# Altium schematic sheet dAir-type-C_0.0.0.4_07052022.SchDoc
size A3
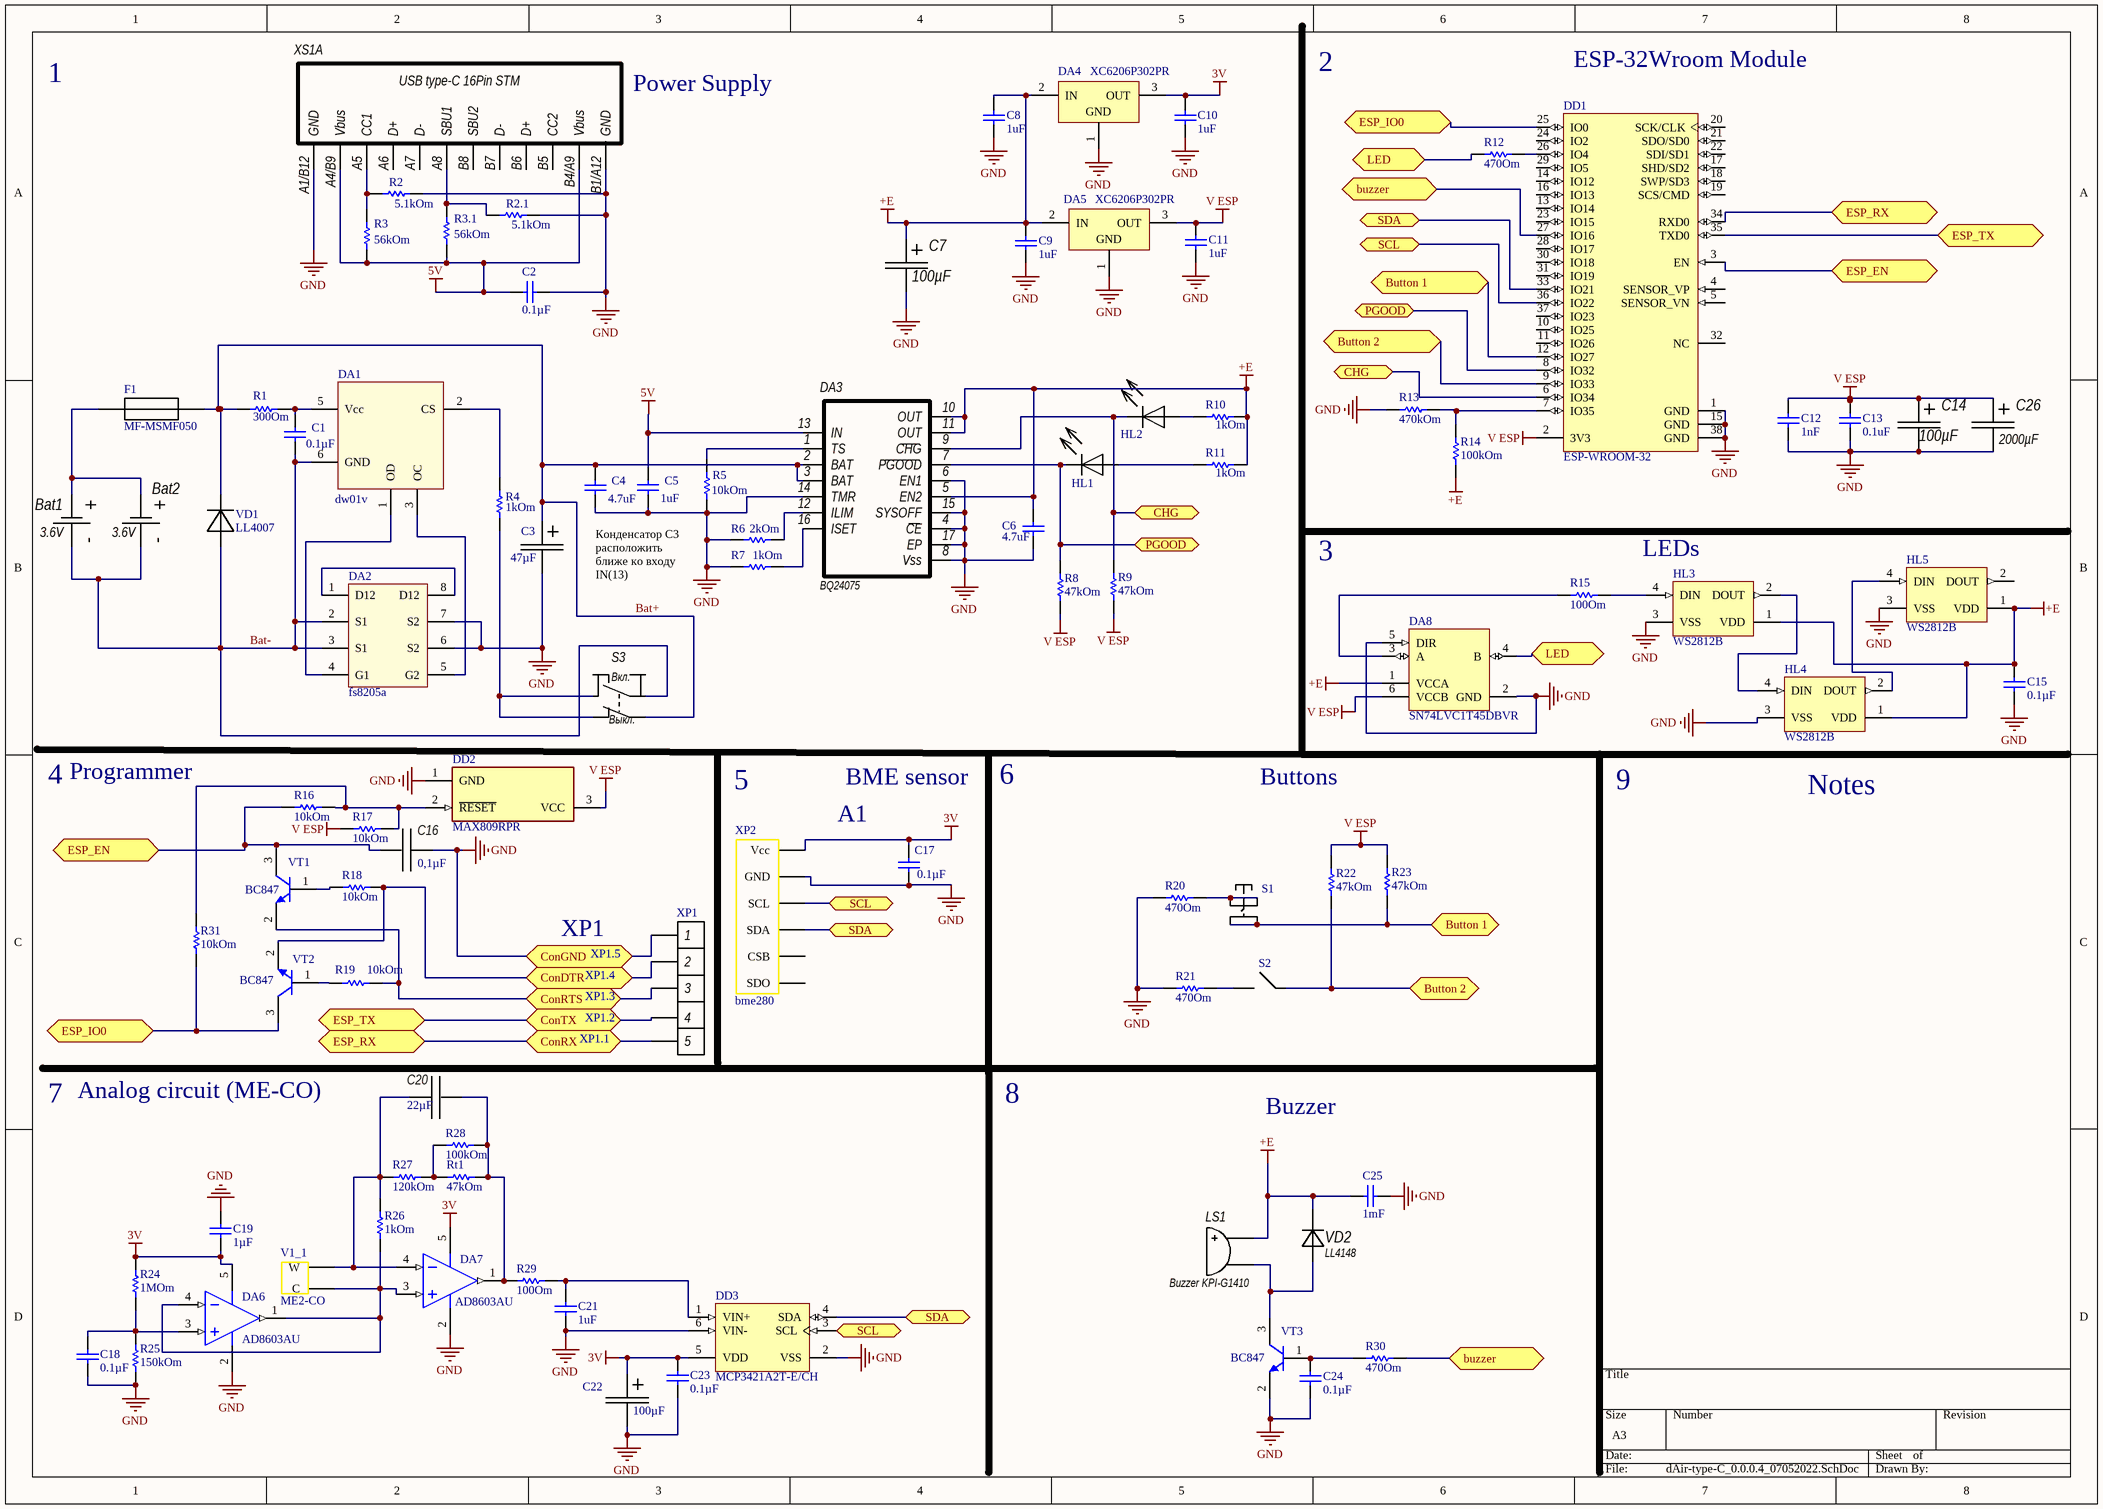
[diagram p0: dAir-type-C_0.0.0.4_07052022.SchDoc]

## Parts
Bat1  3.6V  [Bat_18650_KEYS54]
Bat2  3.6V  [Bat_18650_KEYS54]
C1  0.1µF  [CAPC0805(2012)155_L]
C2  0.1µF  [CAPC0805(2012)155_L]
C3  47µF  [Tantal_type_A_and_B]
C4  4.7uF  [CAPC0805(2012)155_L]
C5  1uF  [CAPC0805(2012)155_L]
C6  4.7uF  [CAPC0805(2012)155_L]
C7  100µF  [Tantal_type_A_and_B]
C8  1uF  [CAPC0805(2012)155_L]
C9  1uF  [CAPC0805(2012)155_L]
C10  1uF  [CAPC0805(2012)155_L]
C11  1uF  [CAPC0805(2012)155_L]
C12  1nF  [CAPC0805(2012)155_L]
C13  0.1uF  [CAPC0805(2012)155_L]
C14  100µF  [Tantal_type_A_and_B]
C15  0.1µF  [CAPC0805(2012)155_L]
C16  0,1µF  [Cap 0805]
C17  0.1µF  [CAPC0805(2012)155_L]
C18  0.1µF  [CAPC0805(2012)155_L]
C19  1µF  [CAPC0805(2012)155_L]
C20  22µF  [Cap 0805]
C21  1uF  [CAPC0805(2012)155_L]
C22  100µF  [Tantal_type_A_and_B]
C23  0.1µF  [CAPC0805(2012)155_L]
C24  0.1µF  [CAPC0805(2012)155_L]
C25  1mF  [CAPC0805(2012)155_L]
C26  2000µF  [Capacitor_radial_13x21_5mm_angel]
DA1  dw01v  [dw01v_SOT-23-6]
DA2  fs8205a  [FS8205_TSSOP-8]
DA3  BQ24075  [VQFN_16]
DA4  XC6206P302PR  [SOT89_N]
DA5  XC6206P302PR  [SOT89_N]
DA6  AD8603AU  [ADI-UJ-5_M]
DA7  AD8603AU  [ADI-UJ-5_M]
DA8  SN74LVC1T45DBVR  [DBV0006A_L]
DD1  ESP-WROOM-32  [OLMX-ESP-WROOM-32]
DD2  MAX809RPR  [FP-318-08-MFG]
DD3  MCP3421A2T-E/CH  [SOT-23-CH6_L]
F1  MF-MSMF050  [FUSE_MF-MSMF050]
HL1  GNL-1206SRC  [LED_SMT-3.2x1.6x1.1]  (value not drawn)
HL2  GNL-1206SRC  [LED_SMT-3.2x1.6x1.1]  (value not drawn)
HL3  WS2812B  [ADAI-WS2812B_V]
HL4  WS2812B  [ADAI-WS2812B_V]
HL5  WS2812B  [ADAI-WS2812B_V]
LS1  Buzzer KPI-G1410  [KPI-G1410]
R1  300Om  [RESC0805(2012)_M]
R2  5.1kOm  [RESC0805(2012)_M]
R2.1  5.1kOm  [RESC0805(2012)_M]
R3  56kOm  [RESC0805(2012)_M]
R3.1  56kOm  [RESC0805(2012)_M]
R4  1kOm  [RESC0805(2012)_M]
R5  10kOm  [RESC0805(2012)_M]
R6  2kOm  [RESC0805(2012)_M]
R7  1kOm  [RESC0805(2012)_M]
R8  47kOm  [RESC0805(2012)_M]
R9  47kOm  [RESC0805(2012)_M]
R10  1kOm  [RESC0805(2012)_M]
R11  1kOm  [RESC0805(2012)_M]
R12  470Om  [RESC0805(2012)_M]
R13  470kOm  [RESC0805(2012)_M]
R14  100kOm  [RESC0805(2012)_M]
R15  100Om  [RESC0805(2012)_M]
R16  10kOm  [RESC0805(2012)_M]
R17  10kOm  [RESC0805(2012)_M]
R18  10kOm  [RESC0805(2012)_M]
R19  10kOm  [RESC0805(2012)_M]
R20  470Om  [RESC0805(2012)_M]
R21  470Om  [RESC0805(2012)_M]
R22  47kOm  [RESC0805(2012)_M]
R23  47kOm  [RESC0805(2012)_M]
R24  1MOm  [RESC0805(2012)_M]
R25  150kOm  [RESC0805(2012)_M]
R26  1kOm  [RESC0805(2012)_M]
R27  120kOm  [RESC0805(2012)_M]
R28  100kOm  [RESC0805(2012)_M]
R29  100Om  [RESC0805(2012)_M]
R30  470Om  [RESC0805(2012)_M]
R31  10kOm  [RESC0805(2012)_M]
Rt1  47kOm  [RESC0805(2012)_M]
S1  KLS7-TS6604-7.0 or IT1102WB  [Кнопка тактовая прямая SMT 7mm]  (value not drawn)
S2  KLS7-TS6606-8.0 or TS-A3PV  [Кнопка тактовая 8,0мм]  (value not drawn)
S3  Кнопка переключающая типа DPDT  [Кнопка типа DPDT 5.8x5.8x10.1 угловая]  (value not drawn)
V1_1  ME2-CO  [ME2_CO]
VD1  LL4007  [MELF/DO-213AB]
VD2  LL4148  [Zener diod (sod80c)]
VT1  BC847  [ONSC-SOT-23-3-318-08_V]
VT2  BC847  [ONSC-SOT-23-3-318-08_V]
VT3  BC847  [ONSC-SOT-23-3-318-08_V]
XP1  XP1  [Pin 5x2.54]  (value not drawn)
XP2  bme280  [BME680 вертикальная утсановка]
XS1A  CON USB_TypeC-16Pin  [USB_type_c_16P_SMT]  (value not drawn)

## Ports
Button 1 (bidir), Button 2 (bidir), buzzer (bidir), CHG (bidir), ConDTR (bidir), ConGND (bidir), ConRTS (bidir), ConRX (bidir), ConTX (bidir), ESP_EN (bidir), ESP_IO0 (bidir), ESP_RX (bidir), ESP_TX (bidir), LED (bidir), PGOOD (bidir), SCL (bidir), SDA (bidir)

## Nets
3V: C10.2 C17.2 C19.1 C22.1(+) C23.2 DA4.3(OUT) DA6.5(+V) DA7.5(+V) DD3.5(VDD) R24.2 XP2.1(Vcc)
5V: C2.1 C5.1 DA3.13(IN) R3.2 R3.1.2 XS1A.A4/B9(Vbus) XS1A.B4/A9(Vbus)
+E: C6.1 C7.1(+) C8.2 C9.2 C15.2 C25.1 DA3.5(EN2) DA3.10(OUT) DA3.11(OUT) DA4.2(IN) DA5.2(IN) DA8.1(VCCA) HL3.1(VDD) HL4.1(VDD) HL5.1(VDD) LS1.1 R10.1 R11.1 R14.2 VD2.1
GND: C2.2 C3.2(-) C4.2 C5.2 C6.2 C7.2(-) C8.1 C9.1 C10.1 C11.1 C12.1 C13.1 C14.2(-) C15.1 C16.2 C17.1 C18.1 C19.2 C21.2 C22.2(-) C23.1 C24.2 C25.2 C26.2(-) DA2.6(S2) DA2.7(S2) DA3.4(CE) DA3.6(EN1) DA3.8(Vss) DA3.14(TMR) DA3.15(SYSOFF) DA3.17(EP) DA4.1(GND) DA5.1(GND) DA6.2(-V) DA7.2(-V) DA8.2(GND) DA8.5(DIR) DD1.1(GND) DD1.15(GND) DD1.38(GND) DD2.1(GND) DD3.2(VSS) DD3.6(VIN-) HL3.3(VSS) HL4.3(VSS) HL5.3(VSS) R2.1 R2.1.1 R5.2 R6.2 R7.2 R13.1 R20.1 R21.1 R25.1 VT3.2(E) XP1.1 XP2.2(GND) XS1A.A1/B12(GND) XS1A.B1/A12(GND) ; port ConGND
V ESP: C11.2 C12.2 C13.2 C14.1(+) C26.1(+) DA5.3(OUT) DA8.6(VCCB) DD1.2(3V3) DD2.3(VCC) R8.1 R9.1 R17.2 R22.2 R23.2
Bat+: C3.1(+) C4.1 DA3.2(BAT) DA3.3(BAT) F1.2 R1.1 S3.3 VD1.1
Bat-: Bat1.2(Bat-) Bat2.2(Bat-) C1.2 DA1.6(GND) DA2.2(S1) DA2.3(S1) S3.4 VD1.2
Button 1: DD1.12(IO27) R23.1 S1.3 S1.4 ; port Button 1
Button 2: DD1.9(IO33) R22.1 S2.2 ; port Button 2
buzzer: DD1.27(IO16) R30.2 ; port buzzer
CHG: DA3.9(CHG) DD1.6(IO34) HL2.1 R9.2 ; port CHG
ConDTR: R18.2 VT2.2(E) XP1.2 ; port ConDTR
ConRTS: R19.2 VT1.2(E) XP1.3 ; port ConRTS
ConRX: DD1.34(RXD0) XP1.5 ; port ConRX, port ESP_RX
ConTX: DD1.35(TXD0) XP1.4 ; port ConTX, port ESP_TX
ESP_EN: C16.1 DD1.3(EN) R16.2 VT1.3(C) ; port ESP_EN
ESP_IO0: DD1.25(IO0) R31.1 VT2.3(C) ; port ESP_IO0
LED: DA8.4(B) R12.1 ; port LED
PGOOD: DA3.7(PGOOD) DD1.8(IO32) HL1.1 R8.2 ; port PGOOD
SCL: DD1.36(IO22) DD3.3(SCL) XP2.3(SCL) ; port SCL
SDA: DD1.33(IO21) DD3.4(SDA) XP2.4(SDA) ; port SDA
NetBat1_1: Bat1.1(Bat+) Bat2.1(Bat+) F1.1
NetC1_1: C1.1 DA1.5(Vcc) R1.2
NetC18_2: C18.2 DA6.3(+IN) R24.1 R25.2
NetC20_1: C20.1 DA7.1(OUT) R28.2 R29.1 Rt1.2
NetC20_2: C20.2 DA7.4(-IN) R26.2 R27.1 V1_1.1W(W)
NetC21_1: C21.1 DD3.1(VIN+) R29.2
NetC24_1: C24.1 R30.1 VT3.1(B)
NetDA1_1: DA1.1(OD) DA2.4(G1)
NetDA1_2: DA1.2(CS) R4.1
NetDA1_3: DA1.3(OC) DA2.5(G2)
NetDA2_1: DA2.1(D12) DA2.8(D12)
NetDA3_1: DA3.1(TS) R5.1
NetDA3_12: DA3.12(ILIM) R6.1
NetDA3_16: DA3.16(ISET) R7.1
NetDA6_1: DA6.1(OUT) DA6.4(-IN) DA7.3(+IN) R26.1 V1_1.2C(C)
NetDA8_3: DA8.3(A) R15.1
NetDD1_7: DD1.7(IO35) R13.2 R14.1
NetDD1_26: DD1.26(IO4) R12.2
NetDD2_2: DD2.2(~{RESET}) R16.1 R17.1 R31.2
NetHL1_2: HL1.2 R11.2
NetHL2_2: HL2.2 R10.2
NetHL3_2: HL3.2(DOUT) HL4.4(DIN)
NetHL3_4: HL3.4(DIN) R15.2
NetHL4_2: HL4.2(DOUT) HL5.4(DIN)
NetLS1_2: LS1.2 VD2.2 VT3.3(C)
NetR2.1_2: R2.1.2 R3.1.1 XS1A.A8(SBU1)
NetR2_2: R2.2 R3.1 XS1A.A5(CC1)
NetR4_2: R4.2 S3.1 S3.2
NetR18_1: R18.1 VT1.1(B)
NetR19_1: R19.1 VT2.1(B)
NetR20_2: R20.2 S1.1 S1.2
NetR21_2: R21.2 S2.1
NetR27_2: R27.2 R28.1 Rt1.1
NetS2_3: S2.3 S2.4
NetS3_3: S3.3 S3.4

Not connected (* = marked no-connect by the designer): DD1 4(SENSOR_VP) 5(SENSOR_VN) 10(IO25) 11(IO26) 13(IO14) 14(IO12) 16(IO13) 17(SHD/SD2) 18(SWP/SD3) 19(SCS/CMD) 20(SCK/CLK) 21(SDO/SD0) 22(SDI/SD1) 23(IO15) 24(IO2) 28(IO17) 29(IO5) 30(IO18) 31(IO19) 32(NC) 37(IO23); HL5 2(DOUT); S3 5(*) 6(*); XP2 5(CSB) 6(SDO); XS1A A6(D+) A7(D-) B5(CC2) B6(D+) B7(D-) B8(SBU2)

## Notes on the sheet
- 1
- (near XS1A) Power Supply
- 2
- (near DD1) ESP-32Wroom Module
- Конденсатор C3 расположить ближе ко входу IN(13)
- 3
- (near HL3) LEDs
- (near S3) Вкл.
- 4
- Programmer
- (near S3) Выкл.
- BME sensor
- 6
- Buttons
- 5
- A1
- 9
- (near HL4) Notes
- XP1
- XP1.4
- XP1.5
- XP1.1
- XP1.2
- XP1.3
- 7
- Analog circuit (ME-CO)
- 8
- Buzzer
- (in symbol USB_TypeC-16Pin) USB type-C 16Pin STM
- (in symbol АКБ_18650_KEYS54) +; -

## Library data of the parts
Bat1 Bat2 = АКБ_18650_KEYS54: Panasonic NCR18650 Li-ion 3200mAh or Liitokala NCR18650 Li-ion 3200mAh
C1 C2 C15 C17 C18 C23 C24 = CMP-1036-04882-1: Ceramic cap 0.1µF 16V ±10%, / 0805 SMD, / X5R or X7R; Case-EIA: 0805; Rated Voltage: 10 V; Value: 4.7uF; Tolerance: Â±10%; Case-Metric: 2012; Max Thickness: 1.55 mm; Technology: SMT
C3 = Cap_electrolitic: Tantal chip cap 47µF 10V ±10%, / type B
C4 C6 = CMP-1036-04882-1: Ceramic cap 4.7µF 16V ±10%, / 0805 SMD, / X5R or X7R; Case-EIA: 0805; Rated Voltage: 10 V; Tolerance: Â±10%; Case-Metric: 2012; Max Thickness: 1.55 mm; Technology: SMT; Value: 4.7uF
C5 C8-C11 = CMP-1036-04882-1: Ceramic cap 1µF 16V ±10%, / 0805 SMD, / X5R or X7R; Case-EIA: 0805; Rated Voltage: 10 V; Value: 4.7uF; Tolerance: Â±10%; Case-Metric: 2012; Max Thickness: 1.55 mm; Technology: SMT
C7 C22 = Cap_electrolitic: Tantal chip cap 100µF 10V ±10%, / type B
C12 = CMP-1036-04882-1: Ceramic cap 1nF 10V ±10%, / 0805 SMD, / X5R or X7R; Case-EIA: 0805; Value: 4.7uF; Tolerance: Â±10%; Case-Metric: 2012; Rated Voltage: 10 V; Max Thickness: 1.55 mm; Technology: SMT
C13 = CMP-1036-04882-1: Ceramic cap 0.1µF 10V ±10%, / 0805 SMD, / X5R or X7R; Case-EIA: 0805; Value: 4.7uF; Tolerance: Â±10%; Case-Metric: 2012; Rated Voltage: 10 V; Max Thickness: 1.55 mm; Technology: SMT
C14 = Cap_electrolitic: Tantal chip cap 100µF 16V ±10%, / type B
C16 = Chip caparators: Ceramic cap 0,1µF 10V ±10%, / 0805 SMD, / X5R or X7R
C19 C21 = CMP-1036-04882-1: Ceramic cap 1µF 10V ±10%, / 0805 SMD, / X5R or X7R; Case-EIA: 0805; Value: 4.7uF; Tolerance: Â±10%; Case-Metric: 2012; Rated Voltage: 10 V; Max Thickness: 1.55 mm; Technology: SMT
C20 = Chip caparators: Ceramic cap 22µF 10V ±10%, / 0805 SMD, / X5R or X7R
C25 = CMP-1036-04882-1: Ceramic cap 1mF 10V ±10%, / 0805 SMD, / X5R or X7R; Case-EIA: 0805; Value: 4.7uF; Tolerance: Â±10%; Case-Metric: 2012; Rated Voltage: 10 V; Max Thickness: 1.55 mm; Technology: SMT
C26 = Cap_electrolitic: Cap electrolitic 2000µF 10V±10%, / Ø13×20mm step 5mm
DA1 = dw01v: Charge controller DW01V, SOT23-6
DA2 = fs8205: Mosfet dual N-channel FS8205a TSSOP-8
DA3 = BQ24075: Battery charger BQ24075, VQFN_16
DA4 DA5 = CMP-0204-00106-1: LDO XC6206P302PR 3V 0.2A, SOT89-3; DatasheetVersion: Rev1.80, Mar-2010; PackageDescription: 3-Pin SOT-89 Package 1.5 mm Pitch, 4.1 mm Lead Span; PackageReference: SOT89; PackageVersion: May-2010; Code_IPC: SOT89
DA6 DA7 = CMP-0384-02070-2: Oper. amplifiers AD8603AU, Rail-to-rail, TSOT-5; Manufacturer: Analog Devices; PartNumber: AD8603AUJ-REEL; Generic Part Number: AD8603; Iq/Amp: 50uA; Input Bias Current: 200fA; V Span Min: 1.8V; Small Signal Bandwidth: 400KHz; Input Offset Voltage: 12uV; V Span Max: 6V; Amplifiers Per Package: 1; Slew Rate: 100mV/us; ComponentLink2Description: Datasheet; RevisionNote: Reference Circuit URL fixed; ComponentLink3URL: http:/www.analog.com/static/imported-files/packages/PKG_PDF/TSOT(UJ)/UJ_5.pdf; ComponentLink1URL: http://www.analog.com/en/index.html; Mounting Technology: Surface Mount; ComponentLink1Description: Manufacturer URL; PackageReference: UJ-5; ComponentLink4Description: Reference Circuit; DatasheetVersion: Rev. C; ComponentLink3Description: Package Specification; PackageVersion: 100708-A; ComponentLink2URL: http://www.analog.com/static/imported-files/data_sheets/AD8603_8607_8609.pdf; PackageDescription: 5-Pin Thin Small Outline Transistor Package, Body 2.9 x 1.6 mm, Pitch 0.95 mm; ComponentLink4URL: http://www.analog.com/en/all-operational-amplifiers-op-amps/operational-amplifiers-op-amps/ad8603/products/product.html#product-recommendations; Code_JEDEC: MO-193-AB
DA8 = CMP-0859-00206-3: Bus Transceiver SN74LVC1T45DBVR, SOT23-6; Manufacturer: Texas Instruments; VCC(Max)(V): 5.5; Input Type: CMOS/TTL; Technology Family: LVC; Voltage(Nom)(V): 1.8,2.5,3.3,5; ICC @ Nom Voltage(Max)(mA): 0.004; Bits(#): 1; F @ Nom Voltage(Max)(Mhz): 150; Output Drive (IOL/IOH)(Max)(mA): 32/-32; 3-State Output: Yes; Logic: True; Schmitt Trigger: No; Output Type: CMOS; Rating: Catalog; tpd @ Nom Voltage(Max)(ns): 15.5,8,5.8,4.4; VCC(Min)(V): 1.65; Sub-Family: Dual Supply Translator; Generic Part Number: SN74LVC1T45; PackageReference: DBV0006A; DatasheetVersion: SCES515K; Operating Temperature Range(C): -40 to 85
DD1 = CMP-2000-07454-1: Microcontroller ESP-WROOM-32, 38-Pin SMD; Manufacturer: Olimex; Package Description: 38-Pin Surface Mount Device, Body 18 x 25.5 mm, Pitch 1.27 mm; Manufacturer URL: https://www.olimex.com; RoHSCompliant: false; Mounting Technology: SurfaceMount; Datasheet Version: Rev. 2.1, 09/2017; Datasheet URL: http://www.espressif.com/sites/default/files/documentation/esp-wroom-32_datasheet_en.pdf; Package Reference: ESP-WROOM-32
DD2 = CMP-07130-000007-1: IC MPU SUPERVISORY MAX809RPR, 2.93V SOT23; Manufacturer: ON SEMICONDUCTOR; Manufacturer Part Number: MAX809STRG; Number Of Outputs: 1; Nominal Supply Current: 0.5-0.8uA; Min Supply Voltage: 1V; Max Junction Temp: +125°C; Max Supply Voltage: 5.5V; Reset Timeout: 10us; Output Current: 20mA; Output Voltage: 0.3V; Reset Type: Active Low; Standoff Height: 0.01mm; Octopart: https://octopart.com/max809strg-on+semiconductor-509853; Category: IC; Temperature: -40°C to +125°C; Temperature Range Low: -40°C; ComponentLink2URL: https://www.onsemi.cn/PowerSolutions/document/MAX809S-D.PDF; Device Class L1: Integrated Circuits (ICs); Automotive: No; Package: 318-08; Device Class L2: Power Management ICs; RoHS: TRUE; Height: 1.11mm; Digikey Description: IC MPU SUPERVISORY 2.93V SOT23; Mouser Description: Supervisory Circuits 2.93V uP Reset; ComponentLink2Description: Datasheet; Temperature Range High: +125°C; Number Of Rails Monitored: 1; Threshold Voltage: 2.93V; Footprint Url: https://www.onsemi.com/pub/Collateral/318-08.PDF; Device Class L3: Voltage Supervisors; Lead Free: Yes
DD3 = CMP-0188-00097-2: ADC MCP3421A2T-E/CH, 2.7-5.5V18-Bit, SOT23-6; ComponentLink3URL: http://www.microchip.com/stellent/groups/techpub_sg/documents/packagingspec/en012702.pdf; DatasheetVersion: revE, Aug-2009; Code_IPC: SOT26A-6; RevisionNote: URLs added.; ComponentLink2URL: http://ww1.microchip.com/downloads/en/DeviceDoc/22003e.pdf; ComponentLink1URL: http://www.microchip.com/; ComponentLink3Description: Package Specification; ComponentLink2Description: Datasheet; PackageReference: SOT-23-CH6; PackageDescription: 6-Lead Plastic Small Outline Transistor (CH) [SOT-23]; PackageVersion: revBB, Aug-2009; ComponentLink1Description: Manufacturer URL
F1 = Fuse: Multifuse MF-MSMF050, 0.5 А, SMD 1812
HL1 HL2 = SMT_LED-3.2x1.6x1.1: SMD LED GNL-1206SCR
HL3-HL5 = CMP-1740-00005-1: SMD LED WS2812B; Case\Package: Radial; Shielding: Unshielded; Current Rating: 240 mA; Tolerance: 10%; Mount: Through Hole; Max Operating Temperature: 125 degC; Radiation Hardening: No; Length: 12.2 mm; Min Operating Temperature: -55 degC; ComponentLink1URL: https://www.adafruit.com/; Packaging: Bulk; Lead Pitch: 5 mm; RoHSCompliant: true; Pins: 2; Package Quantity: 200; ComponentLink2URL: https://cdn-shop.adafruit.com/datasheets/WS2812B.pdf; ComponentLink2Description: Datasheet; PackageDescription: 4-Pin Surface Mount Device, Body 5 x 5 mm, Pitch 3.3 mm; PackageReference: WS2812B; Height: 12.2 mm; REACH SVHC: No SVHC; ComponentLink1Description: Manufacturer URL; DatasheetVersion: May-13
R1 = CMP-1013-00017-1: Res 300Om±5%, SMD 0805; Value: 4.30 Ohm; Tolerance: 5 %; Power: 0.125 W; Case-Metric: 2012; Case-EIA: 0805; Technology: SMT
R2 = CMP-1013-00017-1: Res 5.1kOm±5%, SMD 0805; Value: 4.30 Ohm; Tolerance: 5 %; Power: 0.125 W; Case-Metric: 2012; Case-EIA: 0805; Technology: SMT
R2.1 = CMP-1013-00017-1: Res 5.1Om±5%, SMD 0805; Value: 4.30 Ohm; Tolerance: 5 %; Power: 0.125 W; Case-Metric: 2012; Case-EIA: 0805; Technology: SMT
R3 R3.1 = CMP-1013-00017-1: Res 56kOm±5%, SMD 0805; Value: 4.30 Ohm; Tolerance: 5 %; Power: 0.125 W; Case-Metric: 2012; Case-EIA: 0805; Technology: SMT
R4 R7 R10 R11 R26 = CMP-1013-00017-1: Res 1kOm±5%, SMD 0805; Value: 4.30 Ohm; Tolerance: 5 %; Power: 0.125 W; Case-Metric: 2012; Case-EIA: 0805; Technology: SMT
R5 R16-R19 R31 = CMP-1013-00017-1: Res 10kOm±5%, SMD 0805; Value: 4.30 Ohm; Tolerance: 5 %; Power: 0.125 W; Case-Metric: 2012; Case-EIA: 0805; Technology: SMT
R6 = CMP-1013-00017-1: Res 2kOm±5%, SMD 0805; Value: 4.30 Ohm; Tolerance: 5 %; Power: 0.125 W; Case-Metric: 2012; Case-EIA: 0805; Technology: SMT
R8 R9 R22 R23 Rt1 = CMP-1013-00017-1: Res 47kOm±5%, SMD 0805; Value: 4.30 Ohm; Tolerance: 5 %; Power: 0.125 W; Case-Metric: 2012; Case-EIA: 0805; Technology: SMT
R12 R20 R21 R30 = CMP-1013-00017-1: Res 470Om±5%, SMD 0805; Value: 4.30 Ohm; Tolerance: 5 %; Power: 0.125 W; Case-Metric: 2012; Case-EIA: 0805; Technology: SMT
R13 = CMP-1013-00017-1: Res 470kOm±5%, SMD 0805; Value: 4.30 Ohm; Tolerance: 5 %; Power: 0.125 W; Case-Metric: 2012; Case-EIA: 0805; Technology: SMT
R14 R28 = CMP-1013-00017-1: Res 100kOm±5%, SMD 0805; Value: 4.30 Ohm; Tolerance: 5 %; Power: 0.125 W; Case-Metric: 2012; Case-EIA: 0805; Technology: SMT
R15 R29 = CMP-1013-00017-1: Res 100Om±5%, SMD 0805; Value: 4.30 Ohm; Tolerance: 5 %; Power: 0.125 W; Case-Metric: 2012; Case-EIA: 0805; Technology: SMT
R24 = CMP-1013-00017-1: Res 1MOm±5%, SMD 0805; Value: 4.30 Ohm; Tolerance: 5 %; Power: 0.125 W; Case-Metric: 2012; Case-EIA: 0805; Technology: SMT
R25 = CMP-1013-00017-1: Res 150kOm±5%, SMD 0805; Value: 4.30 Ohm; Tolerance: 5 %; Power: 0.125 W; Case-Metric: 2012; Case-EIA: 0805; Technology: SMT
R27 = CMP-1013-00017-1: Res 120kOm±5%, SMD 0805; Value: 4.30 Ohm; Tolerance: 5 %; Power: 0.125 W; Case-Metric: 2012; Case-EIA: 0805; Technology: SMT
S1 = Кнопка тактовая прямая: Tact switch KLS7-TS6604-7.0 or IT1102WB
S2 = Кнопка тактовая угловая: Tact switch KLS7-TS6606-8.0 or TS-A3PV, TC-0206,                         IT-1102HC,                         IT-1102NC /
V1_1 = ME2 CO: Sensor ME2-CO
VD1 = LL4007: Rectifier diode LL4007, MELF/DO-213AB
VD2 = Diod (sod-80, LL-34): Diod LL4148, SOD-80
VT1-VT3 = CMP-1048-00737-1: NPN-transistor BC847, SOT-23; Manufacturer: On Semiconductor; PartNumber: BC817-25LT1G; IC Continuous (A): 0.5; Packing: Tape and Reel; Polarity: NPN; fT Min (MHz): 100; PackageDescription: 3-Pin Small Outline Transistor, Body 2.92 x 1.3 mm, Pitch 0.95 mm; ComponentLink3Description: Package Specification; ComponentLink2Description: Datasheet; RoHS: TRUE; PackageVersion: Rev. AP, 11/2009; ComponentLink1URL: http://www.onsemi.com/; PackageReference: SOT-23-3-318-08; ComponentLink3URL: http://www.onsemi.cn/pub_link/Collateral/318-08.PDF; ComponentLink2URL: http://www.onsemi.com/pub_link/Collateral/BC817-16LT1-D.PDF; Mounting Technology: Surface Mount; DatasheetVersion: Rev. 12; ComponentLink1Description: Manufacturer URL
XP1 = Pin 5x2.54mm: Pin connector PLS-5 (DS1021-1×5), step 2.54mm
XS1A = USB_TypeC-16Pin: Connector USB Type-C-31-M-12; ST1S10PHR: *